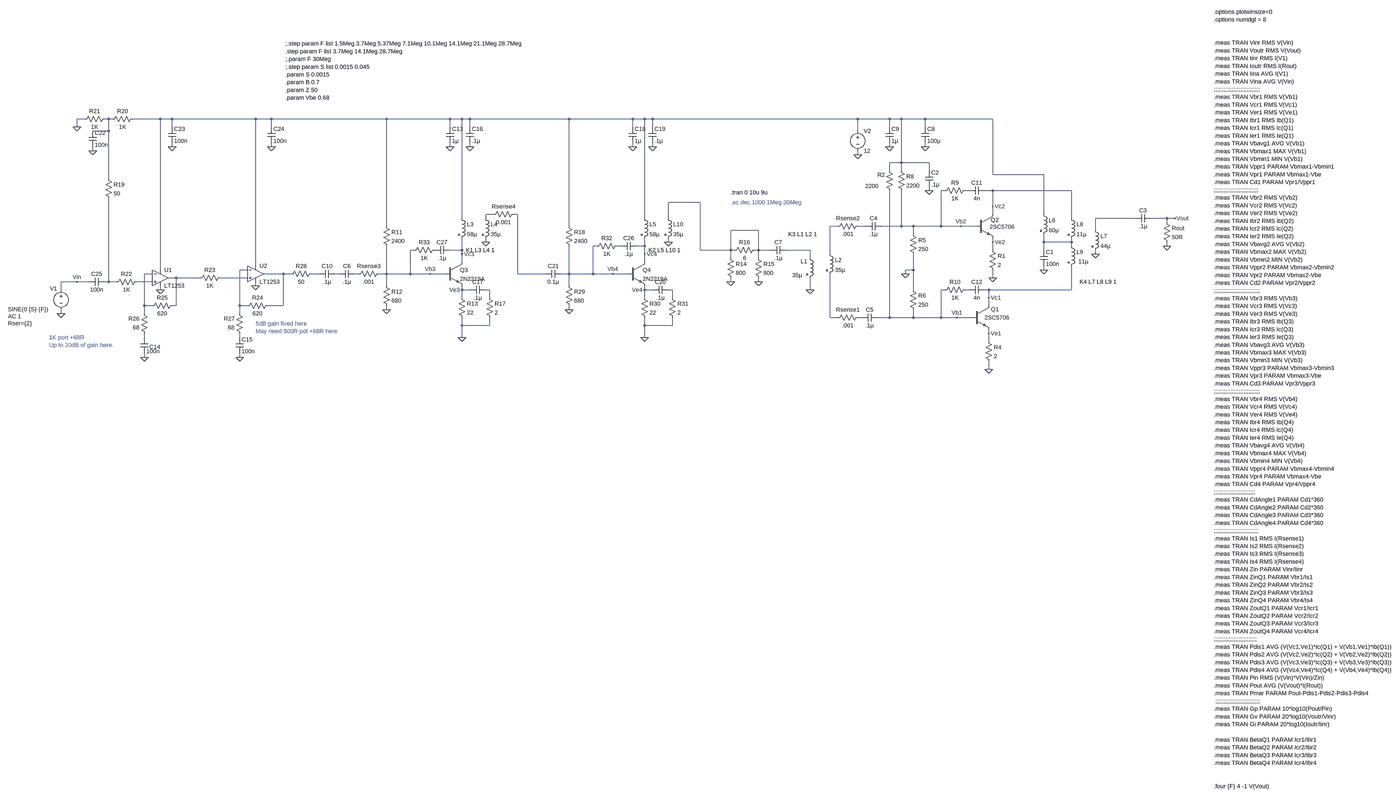
[diagram p0: schematic LT1253+2N2219+SC5706 Push-Pull.asc, whole sheet]
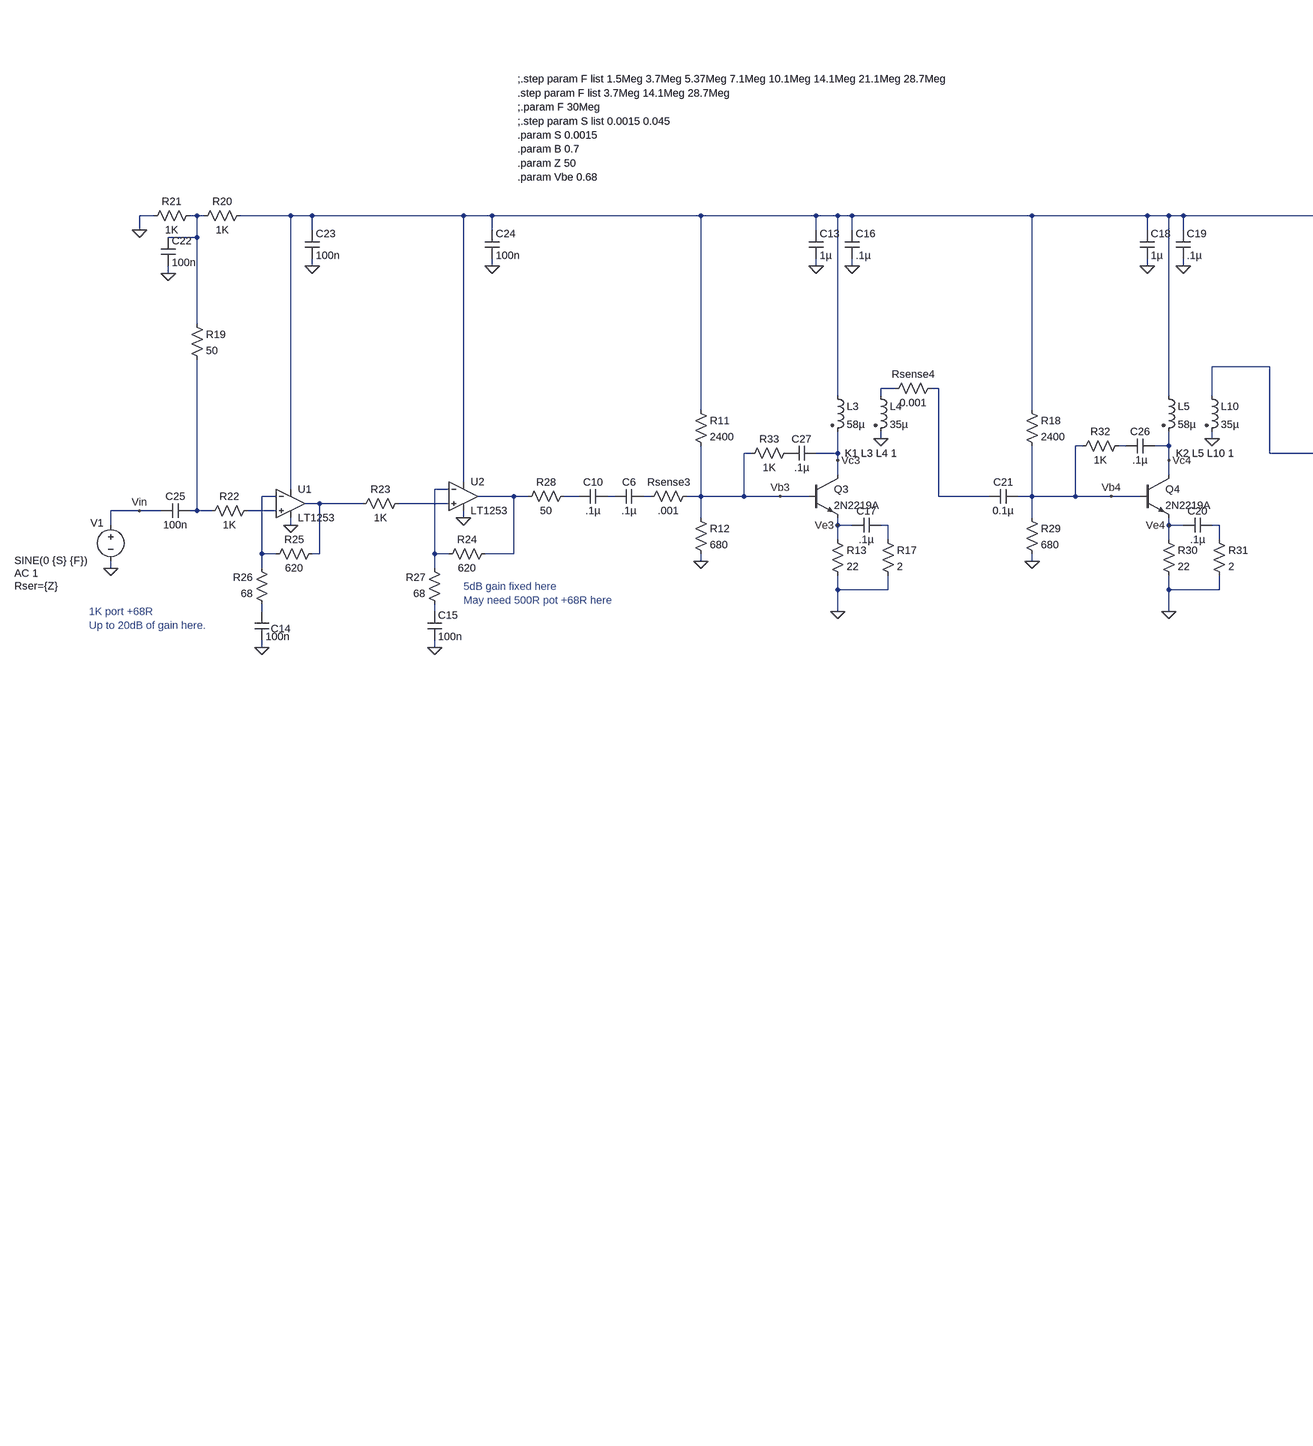
[diagram p1: schematic LT1253+2N2219+SC5706 Push-Pull.asc, part, row 1 of 1, column 1 of 2]
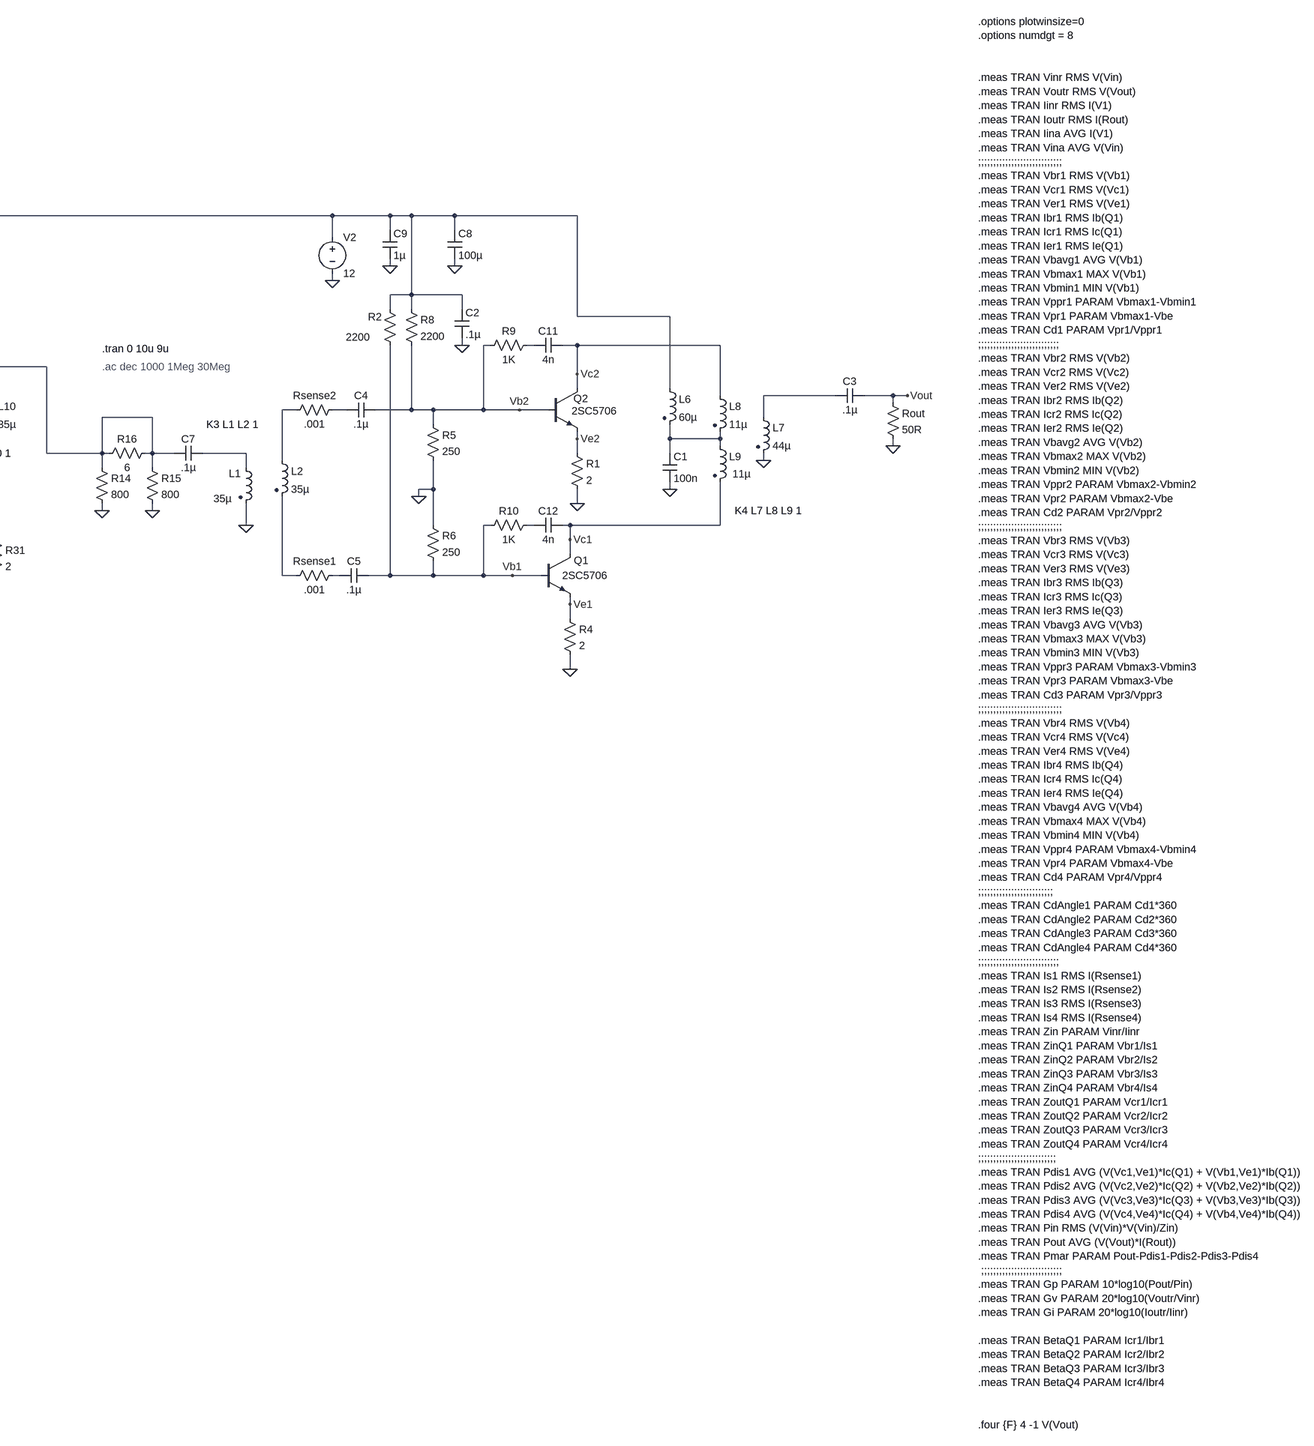
[diagram p2: schematic LT1253+2N2219+SC5706 Push-Pull.asc, part, row 1 of 1, column 2 of 2]
LT1253+2N2219+SC5706 Push-Pull.asc, the LTspice schematic file:
Version 4
SHEET 1 3748 1760
WIRE -2544 -624 -2576 -624
WIRE -2448 -624 -2464 -624
WIRE -2432 -624 -2448 -624
WIRE -2240 -624 -2352 -624
WIRE -2192 -624 -2240 -624
WIRE -1856 -624 -2192 -624
WIRE -1792 -624 -1856 -624
WIRE -1328 -624 -1792 -624
WIRE -1072 -624 -1328 -624
WIRE -1024 -624 -1072 -624
WIRE -992 -624 -1024 -624
WIRE -592 -624 -992 -624
WIRE -336 -624 -592 -624
WIRE -288 -624 -336 -624
WIRE -256 -624 -288 -624
WIRE 576 -624 -256 -624
WIRE 704 -624 576 -624
WIRE 752 -624 704 -624
WIRE 848 -624 752 -624
WIRE 1120 -624 848 -624
WIRE -2576 -592 -2576 -624
WIRE -2192 -592 -2192 -624
WIRE -1792 -592 -1792 -624
WIRE -1072 -592 -1072 -624
WIRE -992 -592 -992 -624
WIRE -336 -592 -336 -624
WIRE -256 -592 -256 -624
WIRE 704 -592 704 -624
WIRE 848 -592 848 -624
WIRE -2448 -576 -2448 -624
WIRE -2448 -576 -2512 -576
WIRE 576 -576 576 -624
WIRE -2192 -512 -2192 -528
WIRE -1792 -512 -1792 -528
WIRE -1072 -512 -1072 -528
WIRE -992 -512 -992 -528
WIRE -336 -512 -336 -528
WIRE -256 -512 -256 -528
WIRE 704 -512 704 -528
WIRE 848 -512 848 -528
WIRE -2512 -496 -2512 -512
WIRE 576 -480 576 -496
WIRE 752 -448 752 -624
WIRE 752 -448 704 -448
WIRE 864 -448 752 -448
WIRE 704 -416 704 -448
WIRE 752 -416 752 -448
WIRE 864 -416 864 -448
WIRE 1120 -400 1120 -624
WIRE 1376 -400 1120 -400
WIRE -2448 -384 -2448 -576
WIRE 864 -336 864 -352
WIRE 928 -336 912 -336
WIRE 1024 -336 1008 -336
WIRE 1120 -336 1088 -336
WIRE 1488 -336 1120 -336
WIRE -64 -288 -192 -288
WIRE 1120 -272 1120 -336
WIRE -896 -240 -928 -240
WIRE -800 -240 -816 -240
WIRE 1120 -240 1120 -272
WIRE 1376 -240 1376 -400
WIRE -1024 -224 -1024 -624
WIRE -928 -224 -928 -240
WIRE -288 -224 -288 -624
WIRE -192 -224 -192 -288
WIRE 1488 -224 1488 -336
WIRE 1744 -224 1584 -224
WIRE 1872 -224 1808 -224
WIRE 1904 -224 1872 -224
WIRE 1872 -208 1872 -224
WIRE -1328 -192 -1328 -624
WIRE -592 -192 -592 -624
WIRE 496 -192 464 -192
WIRE 608 -192 576 -192
WIRE 752 -192 752 -336
WIRE 752 -192 672 -192
WIRE 800 -192 752 -192
WIRE 912 -192 912 -336
WIRE 912 -192 800 -192
WIRE 992 -192 912 -192
WIRE 1056 -192 992 -192
WIRE 176 -176 64 -176
WIRE 1584 -176 1584 -224
WIRE 800 -160 800 -192
WIRE -928 -128 -928 -144
WIRE -192 -128 -192 -144
WIRE 1120 -128 1120 -144
WIRE 1376 -128 1376 -160
WIRE 1488 -128 1488 -144
WIRE 1488 -128 1376 -128
WIRE -480 -112 -496 -112
WIRE -384 -112 -400 -112
WIRE -288 -112 -288 -144
WIRE -288 -112 -320 -112
WIRE 1488 -112 1488 -128
WIRE 1872 -112 1872 -128
WIRE -1216 -96 -1232 -96
WIRE -1024 -96 -1024 -144
WIRE -1024 -96 -1072 -96
WIRE -64 -96 -64 -288
WIRE 64 -96 64 -176
WIRE 64 -96 -64 -96
WIRE 80 -96 64 -96
WIRE 176 -96 176 -176
WIRE 176 -96 160 -96
WIRE 224 -96 176 -96
WIRE 384 -96 288 -96
WIRE 1120 -96 1120 -128
WIRE 1376 -96 1376 -128
WIRE -1024 -80 -1024 -96
WIRE -288 -80 -288 -112
WIRE 464 -80 464 -192
WIRE 1584 -80 1584 -96
WIRE 64 -64 64 -96
WIRE 176 -64 176 -96
WIRE 384 -64 384 -96
WIRE -1024 -48 -1024 -80
WIRE -288 -48 -288 -80
WIRE -1856 -32 -1856 -624
WIRE -2240 -16 -2240 -624
WIRE -1888 -16 -1920 -16
WIRE 800 -16 800 -80
WIRE 800 -16 768 -16
WIRE 1376 -16 1376 -32
WIRE -2272 0 -2304 0
WIRE -1744 0 -1824 0
WIRE -1712 0 -1744 0
WIRE -1600 0 -1632 0
WIRE -1520 0 -1536 0
WIRE -1440 0 -1456 0
WIRE -1328 0 -1328 -112
WIRE -1328 0 -1360 0
WIRE -1232 0 -1232 -96
WIRE -1232 0 -1328 0
WIRE -1152 0 -1232 0
WIRE -1088 0 -1152 0
WIRE -800 0 -800 -240
WIRE -688 0 -800 0
WIRE -592 0 -592 -112
WIRE -592 0 -624 0
WIRE -496 0 -496 -112
WIRE -496 0 -592 0
WIRE -416 0 -496 0
WIRE -352 0 -416 0
WIRE 768 0 768 -16
WIRE -2176 16 -2208 16
WIRE -2080 16 -2176 16
WIRE -1888 16 -2000 16
WIRE 1120 16 1120 -16
WIRE -2576 32 -2640 32
WIRE -2528 32 -2576 32
WIRE -2448 32 -2448 -304
WIRE -2448 32 -2464 32
WIRE -2416 32 -2448 32
WIRE -2272 32 -2336 32
WIRE 64 32 64 16
WIRE 176 32 176 16
WIRE -1856 48 -1856 32
WIRE -1328 48 -1328 0
WIRE -592 48 -592 0
WIRE -2640 64 -2640 32
WIRE -2240 64 -2240 48
WIRE -1024 64 -1024 48
WIRE -992 64 -1024 64
WIRE -912 64 -928 64
WIRE -288 64 -288 48
WIRE -256 64 -288 64
WIRE -176 64 -192 64
WIRE 384 64 384 16
WIRE 800 64 800 -16
WIRE 928 64 912 64
WIRE 1024 64 1008 64
WIRE 1104 64 1088 64
WIRE 1488 64 1488 -32
WIRE 1488 64 1104 64
WIRE -1024 96 -1024 64
WIRE -912 96 -912 64
WIRE -288 96 -288 64
WIRE -176 96 -176 64
WIRE 1104 96 1104 64
WIRE -2304 128 -2304 0
WIRE -2272 128 -2304 128
WIRE -2176 128 -2176 16
WIRE -2176 128 -2192 128
WIRE -1920 128 -1920 -16
WIRE -1888 128 -1920 128
WIRE -1744 128 -1744 0
WIRE -1744 128 -1808 128
WIRE 1104 128 1104 96
WIRE -1328 144 -1328 128
WIRE -592 144 -592 128
WIRE -2640 160 -2640 144
WIRE -2304 160 -2304 128
WIRE -1920 160 -1920 128
WIRE 464 176 464 0
WIRE 496 176 464 176
WIRE 592 176 576 176
WIRE 704 176 704 -336
WIRE 704 176 656 176
WIRE 800 176 800 144
WIRE 800 176 704 176
WIRE 912 176 912 64
WIRE 912 176 800 176
WIRE 976 176 912 176
WIRE 1040 176 976 176
WIRE -1024 208 -1024 176
WIRE -912 208 -912 176
WIRE -912 208 -1024 208
WIRE -288 208 -288 176
WIRE -176 208 -176 176
WIRE -176 208 -288 208
WIRE 1104 240 1104 224
WIRE -2304 256 -2304 240
WIRE -1920 256 -1920 240
WIRE -1024 256 -1024 208
WIRE -288 256 -288 208
WIRE 1104 272 1104 240
WIRE -2304 336 -2304 320
WIRE -1920 336 -1920 320
WIRE 1104 384 1104 352
FLAG 576 -480 0
FLAG -2640 160 0
FLAG 1104 384 0
FLAG 1904 -224 Vout
FLAG 1872 -112 0
FLAG 976 176 Vb1
FLAG 1104 240 Ve1
FLAG -2576 32 Vin
FLAG 1104 96 Vc1
FLAG 1120 16 0
FLAG 992 -192 Vb2
FLAG 1120 -128 Ve2
FLAG 1120 -272 Vc2
FLAG 384 64 0
FLAG 768 0 0
FLAG 1376 -16 0
FLAG 864 -336 0
FLAG 704 -512 0
FLAG 1584 -80 0
FLAG 848 -512 0
FLAG 64 32 0
FLAG 176 32 0
FLAG -2192 -512 0
FLAG -2512 -496 0
FLAG -2240 64 0
FLAG -1856 48 0
FLAG -1920 336 0
FLAG -1792 -512 0
FLAG -2576 -592 0
FLAG -2304 336 0
FLAG -1328 144 0
FLAG -1024 256 0
FLAG -1072 -512 0
FLAG -992 -512 0
FLAG -1152 0 Vb3
FLAG -1024 64 Ve3
FLAG -1024 -80 Vc3
FLAG -928 -128 0
FLAG -592 144 0
FLAG -288 256 0
FLAG -336 -512 0
FLAG -256 -512 0
FLAG -416 0 Vb4
FLAG -288 64 Ve4
FLAG -288 -80 Vc4
FLAG -192 -128 0
SYMBOL npn 1040 128 R0
WINDOW 0 73 15 Left 2
WINDOW 3 47 48 Left 2
SYMATTR InstName Q1
SYMATTR Value 2SC5706
SYMBOL voltage -2640 48 R0
WINDOW 0 -45 11 Left 2
WINDOW 3 -214 95 Left 2
WINDOW 123 -214 123 Left 2
WINDOW 39 -214 151 Left 2
SYMATTR InstName V1
SYMATTR Value SINE(0 {S} {F})
SYMATTR Value2 AC 1
SYMATTR SpiceLine Rser={Z}
SYMBOL voltage 576 -592 R0
WINDOW 123 0 0 Left 0
WINDOW 39 0 0 Left 0
SYMATTR InstName V2
SYMATTR Value 12
SYMBOL res 1088 256 R0
SYMATTR InstName R4
SYMATTR Value 2
SYMBOL cap 1808 -240 R90
WINDOW 0 0 32 VBottom 2
WINDOW 3 32 32 VTop 2
SYMATTR InstName C3
SYMATTR Value .1µ
SYMBOL res 1856 -224 R0
SYMATTR InstName Rout
SYMATTR Value 50R
SYMBOL cap 288 -112 R90
WINDOW 0 0 32 VBottom 2
WINDOW 3 32 32 VTop 2
SYMATTR InstName C7
SYMATTR Value .1µ
SYMBOL npn 1056 -240 R0
WINDOW 0 56 23 Left 2
WINDOW 3 52 50 Left 2
SYMATTR InstName Q2
SYMATTR Value 2SC5706
SYMBOL res 1104 -112 R0
SYMATTR InstName R1
SYMATTR Value 2
SYMBOL ind2 368 -80 R0
WINDOW 0 -22 29 Left 2
WINDOW 3 -56 85 Left 2
SYMATTR InstName L1
SYMATTR Value 35µ
SYMATTR Type ind
SYMBOL ind2 448 -96 R0
SYMATTR InstName L2
SYMATTR Value 35µ
SYMATTR Type ind
SYMBOL res 736 -432 R0
SYMATTR InstName R8
SYMATTR Value 2200
SYMBOL res 784 -176 R0
SYMATTR InstName R5
SYMATTR Value 250
SYMBOL res 784 48 R0
SYMATTR InstName R6
SYMATTR Value 250
SYMBOL ind2 1472 -240 R0
SYMATTR InstName L8
SYMATTR Value 11µ
SYMATTR Type ind
SYMBOL ind2 1472 -128 R0
WINDOW 3 43 78 Left 2
SYMATTR Value 11µ
SYMATTR InstName L9
SYMATTR Type ind
SYMBOL ind2 1568 -192 R0
SYMATTR InstName L7
SYMATTR Value 44µ
SYMATTR Type ind
SYMBOL ind2 1360 -256 R0
SYMATTR InstName L6
SYMATTR Value 60µ
SYMATTR Type ind
SYMBOL cap 1360 -96 R0
SYMATTR InstName C1
SYMATTR Value 100n
SYMBOL cap 848 -416 R0
SYMATTR InstName C2
SYMATTR Value .1µ
SYMBOL cap 688 -592 R0
SYMATTR InstName C9
SYMATTR Value 1µ
SYMBOL res 688 -432 R0
WINDOW 0 -33 33 Left 2
WINDOW 3 -82 78 Left 2
SYMATTR InstName R2
SYMATTR Value 2200
SYMBOL cap 832 -592 R0
SYMATTR InstName C8
SYMATTR Value 100µ
SYMBOL res 592 -208 R90
WINDOW 0 0 56 VBottom 2
WINDOW 3 32 56 VTop 2
SYMATTR InstName Rsense2
SYMATTR Value .001
SYMBOL res 592 160 R90
WINDOW 0 0 56 VBottom 2
WINDOW 3 32 56 VTop 2
SYMATTR InstName Rsense1
SYMATTR Value .001
SYMBOL cap 672 -208 R90
WINDOW 0 0 32 VBottom 2
WINDOW 3 32 32 VTop 2
SYMATTR InstName C4
SYMATTR Value .1µ
SYMBOL cap 656 160 R90
WINDOW 0 0 32 VBottom 2
WINDOW 3 32 32 VTop 2
SYMATTR InstName C5
SYMATTR Value .1µ
SYMBOL cap 1088 -352 R90
WINDOW 0 0 32 VBottom 2
WINDOW 3 32 32 VTop 2
SYMATTR InstName C11
SYMATTR Value 4n
SYMBOL res 1024 -352 R90
WINDOW 0 0 56 VBottom 2
WINDOW 3 32 56 VTop 2
SYMATTR InstName R9
SYMATTR Value 1K
SYMBOL cap 1088 48 R90
WINDOW 0 0 32 VBottom 2
WINDOW 3 32 32 VTop 2
SYMATTR InstName C12
SYMATTR Value 4n
SYMBOL res 1024 48 R90
WINDOW 0 0 56 VBottom 2
WINDOW 3 32 56 VTop 2
SYMATTR InstName R10
SYMATTR Value 1K
SYMBOL res 48 -80 R0
SYMATTR InstName R14
SYMATTR Value 800
SYMBOL res 160 -80 R0
SYMATTR InstName R15
SYMATTR Value 800
SYMBOL res 176 -112 R90
WINDOW 0 0 56 VBottom 2
WINDOW 3 32 56 VTop 2
SYMATTR InstName R16
SYMATTR Value 6
SYMBOL Opamps\\LT1253 -2240 -48 R0
SYMATTR InstName U1
SYMBOL Opamps\\LT1253 -1856 -64 R0
SYMATTR InstName U2
SYMBOL res -2464 -400 R0
SYMATTR InstName R19
SYMATTR Value 50
SYMBOL res -2336 -640 R90
WINDOW 0 0 56 VBottom 2
WINDOW 3 32 56 VTop 2
SYMATTR InstName R20
SYMATTR Value 1K
SYMBOL res -2448 -640 R90
WINDOW 0 0 56 VBottom 2
WINDOW 3 32 56 VTop 2
SYMATTR InstName R21
SYMATTR Value 1K
SYMBOL res -2320 16 R90
WINDOW 0 0 56 VBottom 2
WINDOW 3 32 56 VTop 2
SYMATTR InstName R22
SYMATTR Value 1K
SYMBOL res -1984 0 R90
WINDOW 0 0 56 VBottom 2
WINDOW 3 32 56 VTop 2
SYMATTR InstName R23
SYMATTR Value 1K
SYMBOL res -1792 112 R90
WINDOW 0 0 56 VBottom 2
WINDOW 3 32 56 VTop 2
SYMATTR InstName R24
SYMATTR Value 620
SYMBOL res -2176 112 R90
WINDOW 0 0 56 VBottom 2
WINDOW 3 32 56 VTop 2
SYMATTR InstName R25
SYMATTR Value 620
SYMBOL res -2288 256 R180
WINDOW 0 36 76 Left 2
WINDOW 3 36 40 Left 2
SYMATTR InstName R26
SYMATTR Value 68
SYMBOL res -1904 256 R180
WINDOW 0 36 76 Left 2
WINDOW 3 36 40 Left 2
SYMATTR InstName R27
SYMATTR Value 68
SYMBOL cap -2320 256 R0
WINDOW 0 36 38 Left 2
SYMATTR InstName C14
SYMATTR Value 100n
SYMBOL cap -1936 256 R0
SYMATTR InstName C15
SYMATTR Value 100n
SYMBOL cap -2528 -576 R0
SYMATTR InstName C22
SYMATTR Value 100n
SYMBOL cap -2208 -592 R0
SYMATTR InstName C23
SYMATTR Value 100n
SYMBOL cap -1808 -592 R0
SYMATTR InstName C24
SYMATTR Value 100n
SYMBOL cap -2464 16 R90
WINDOW 0 0 32 VBottom 2
WINDOW 3 32 32 VTop 2
SYMATTR InstName C25
SYMATTR Value 100n
SYMBOL res -1616 -16 R90
WINDOW 0 0 56 VBottom 2
WINDOW 3 32 56 VTop 2
SYMATTR InstName R28
SYMATTR Value 50
SYMBOL res -1344 -16 R90
WINDOW 0 0 56 VBottom 2
WINDOW 3 32 56 VTop 2
SYMATTR InstName Rsense3
SYMATTR Value .001
SYMBOL res -1344 -208 R0
SYMATTR InstName R11
SYMATTR Value 2400
SYMBOL res -1344 32 R0
SYMATTR InstName R12
SYMATTR Value 680
SYMBOL res -1040 80 R0
SYMATTR InstName R13
SYMATTR Value 22
SYMBOL ind2 -1040 -240 R0
SYMATTR InstName L3
SYMATTR Value 58µ
SYMATTR Type ind
SYMBOL cap -1088 -592 R0
SYMATTR InstName C13
SYMATTR Value 1µ
SYMBOL cap -1008 -592 R0
SYMATTR InstName C16
SYMATTR Value .1µ
SYMBOL cap -928 48 R90
WINDOW 0 0 32 VBottom 2
WINDOW 3 32 32 VTop 2
SYMATTR InstName C17
SYMATTR Value .1µ
SYMBOL ind2 -944 -240 R0
SYMATTR InstName L4
SYMATTR Value 35µ
SYMATTR Type ind
SYMBOL npn -1088 -48 R0
SYMATTR InstName Q3
SYMATTR Value 2N2219A
SYMBOL res -928 80 R0
SYMATTR InstName R17
SYMATTR Value 2
SYMBOL res -608 -208 R0
SYMATTR InstName R18
SYMATTR Value 2400
SYMBOL res -608 32 R0
SYMATTR InstName R29
SYMATTR Value 680
SYMBOL res -304 80 R0
SYMATTR InstName R30
SYMATTR Value 22
SYMBOL ind2 -304 -240 R0
SYMATTR InstName L5
SYMATTR Value 58µ
SYMATTR Type ind
SYMBOL cap -352 -592 R0
SYMATTR InstName C18
SYMATTR Value 1µ
SYMBOL cap -272 -592 R0
SYMATTR InstName C19
SYMATTR Value .1µ
SYMBOL cap -192 48 R90
WINDOW 0 0 32 VBottom 2
WINDOW 3 32 32 VTop 2
SYMATTR InstName C20
SYMATTR Value .1µ
SYMBOL ind2 -208 -240 R0
SYMATTR InstName L10
SYMATTR Value 35µ
SYMATTR Type ind
SYMBOL npn -352 -48 R0
SYMATTR InstName Q4
SYMATTR Value 2N2219A
SYMBOL res -192 80 R0
SYMATTR InstName R31
SYMATTR Value 2
SYMBOL cap -624 -16 R90
WINDOW 0 0 32 VBottom 2
WINDOW 3 32 32 VTop 2
SYMATTR InstName C21
SYMATTR Value 0.1µ
SYMBOL res -800 -256 R90
WINDOW 0 0 56 VBottom 2
WINDOW 3 32 56 VTop 2
SYMATTR InstName Rsense4
SYMATTR Value 0.001
SYMBOL cap -320 -128 R90
WINDOW 0 0 32 VBottom 2
WINDOW 3 32 32 VTop 2
SYMATTR InstName C26
SYMATTR Value .1µ
SYMBOL res -384 -128 R90
WINDOW 0 0 56 VBottom 2
WINDOW 3 32 56 VTop 2
SYMATTR InstName R32
SYMATTR Value 1K
SYMBOL cap -1072 -112 R90
WINDOW 0 0 32 VBottom 2
WINDOW 3 32 32 VTop 2
SYMATTR InstName C27
SYMATTR Value .1µ
SYMBOL res -1120 -112 R90
WINDOW 0 0 56 VBottom 2
WINDOW 3 32 56 VTop 2
SYMATTR InstName R33
SYMATTR Value 1K
SYMBOL cap -1456 -16 R90
WINDOW 0 0 32 VBottom 2
WINDOW 3 32 32 VTop 2
SYMATTR InstName C6
SYMATTR Value .1µ
SYMBOL cap -1536 -16 R90
WINDOW 0 0 32 VBottom 2
WINDOW 3 32 32 VTop 2
SYMATTR InstName C10
SYMATTR Value .1µ
TEXT 64 -328 Left 2 !.tran 0 10u 9u
TEXT 2248 -1056 Left 2 !.options plotwinsize=0\n.options numdgt = 8\n \n \n.meas TRAN Vinr RMS V(Vin)\n.meas TRAN Voutr RMS V(Vout)\n.meas TRAN Iinr RMS I(V1)\n.meas TRAN Ioutr RMS I(Rout)\n.meas TRAN Iina AVG I(V1)\n.meas TRAN Vina AVG V(Vin)\n;;;;;;;;;;;;;;;;;;;;;;;;;;;;\n.meas TRAN Vbr1 RMS V(Vb1)\n.meas TRAN Vcr1 RMS V(Vc1)\n.meas TRAN Ver1 RMS V(Ve1)\n.meas TRAN Ibr1 RMS Ib(Q1)\n.meas TRAN Icr1 RMS Ic(Q1)\n.meas TRAN Ier1 RMS Ie(Q1)\n.meas TRAN Vbavg1 AVG V(Vb1)\n.meas TRAN Vbmax1 MAX V(Vb1)\n.meas TRAN Vbmin1 MIN V(Vb1)\n.meas TRAN Vppr1 PARAM Vbmax1-Vbmin1\n.meas TRAN Vpr1 PARAM Vbmax1-Vbe\n.meas TRAN Cd1 PARAM Vpr1/Vppr1\n;;;;;;;;;;;;;;;;;;;;;;;;;;;\n.meas TRAN Vbr2 RMS V(Vb2)\n.meas TRAN Vcr2 RMS V(Vc2)\n.meas TRAN Ver2 RMS V(Ve2)\n.meas TRAN Ibr2 RMS Ib(Q2)\n.meas TRAN Icr2 RMS Ic(Q2)\n.meas TRAN Ier2 RMS Ie(Q2)\n.meas TRAN Vbavg2 AVG V(Vb2)\n.meas TRAN Vbmax2 MAX V(Vb2)\n.meas TRAN Vbmin2 MIN V(Vb2)\n.meas TRAN Vppr2 PARAM Vbmax2-Vbmin2\n.meas TRAN Vpr2 PARAM Vbmax2-Vbe\n.meas TRAN Cd2 PARAM Vpr2/Vppr2\n;;;;;;;;;;;;;;;;;;;;;;;;;;;;\n.meas TRAN Vbr3 RMS V(Vb3)\n.meas TRAN Vcr3 RMS V(Vc3)\n.meas TRAN Ver3 RMS V(Ve3)\n.meas TRAN Ibr3 RMS Ib(Q3)\n.meas TRAN Icr3 RMS Ic(Q3)\n.meas TRAN Ier3 RMS Ie(Q3)\n.meas TRAN Vbavg3 AVG V(Vb3)\n.meas TRAN Vbmax3 MAX V(Vb3)\n.meas TRAN Vbmin3 MIN V(Vb3)\n.meas TRAN Vppr3 PARAM Vbmax3-Vbmin3\n.meas TRAN Vpr3 PARAM Vbmax3-Vbe\n.meas TRAN Cd3 PARAM Vpr3/Vppr3\n;;;;;;;;;;;;;;;;;;;;;;;;;;;;\n.meas TRAN Vbr4 RMS V(Vb4)\n.meas TRAN Vcr4 RMS V(Vc4)\n.meas TRAN Ver4 RMS V(Ve4)\n.meas TRAN Ibr4 RMS Ib(Q4)\n.meas TRAN Icr4 RMS Ic(Q4)\n.meas TRAN Ier4 RMS Ie(Q4)\n.meas TRAN Vbavg4 AVG V(Vb4)\n.meas TRAN Vbmax4 MAX V(Vb4)\n.meas TRAN Vbmin4 MIN V(Vb4)\n.meas TRAN Vppr4 PARAM Vbmax4-Vbmin4\n.meas TRAN Vpr4 PARAM Vbmax4-Vbe\n.meas TRAN Cd4 PARAM Vpr4/Vppr4\n;;;;;;;;;;;;;;;;;;;;;;;;;\n.meas TRAN CdAngle1 PARAM Cd1*360\n.meas TRAN CdAngle2 PARAM Cd2*360\n.meas TRAN CdAngle3 PARAM Cd3*360\n.meas TRAN CdAngle4 PARAM Cd4*360\n;;;;;;;;;;;;;;;;;;;;;;;;;;;\n.meas TRAN Is1 RMS I(Rsense1)\n.meas TRAN Is2 RMS I(Rsense2)\n.meas TRAN Is3 RMS I(Rsense3)\n.meas TRAN Is4 RMS I(Rsense4)\n.meas TRAN Zin PARAM Vinr/Iinr\n.meas TRAN ZinQ1 PARAM Vbr1/Is1\n.meas TRAN ZinQ2 PARAM Vbr2/Is2 \n.meas TRAN ZinQ3 PARAM Vbr3/Is3 \n.meas TRAN ZinQ4 PARAM Vbr4/Is4 \n.meas TRAN ZoutQ1 PARAM Vcr1/Icr1\n.meas TRAN ZoutQ2 PARAM Vcr2/Icr2\n.meas TRAN ZoutQ3 PARAM Vcr3/Icr3\n.meas TRAN ZoutQ4 PARAM Vcr4/Icr4\n;;;;;;;;;;;;;;;;;;;;;;;;;;\n.meas TRAN Pdis1 AVG (V(Vc1,Ve1)*Ic(Q1) + V(Vb1,Ve1)*Ib(Q1))\n.meas TRAN Pdis2 AVG (V(Vc2,Ve2)*Ic(Q2) + V(Vb2,Ve2)*Ib(Q2))\n.meas TRAN Pdis3 AVG (V(Vc3,Ve3)*Ic(Q3) + V(Vb3,Ve3)*Ib(Q3))\n.meas TRAN Pdis4 AVG (V(Vc4,Ve4)*Ic(Q4) + V(Vb4,Ve4)*Ib(Q4))\n.meas TRAN Pin RMS (V(Vin)*V(Vin)/Zin)\n.meas TRAN Pout AVG (V(Vout)*I(Rout))\n.meas TRAN Pmar PARAM Pout-Pdis1-Pdis2-Pdis3-Pdis4\n ;;;;;;;;;;;;;;;;;;;;;;;;;;;\n.meas TRAN Gp PARAM 10*log10(Pout/Pin)\n.meas TRAN Gv PARAM 20*log10(Voutr/Vinr)\n.meas TRAN Gi PARAM 20*log10(Ioutr/Iinr)\n \n.meas TRAN BetaQ1 PARAM Icr1/Ibr1\n.meas TRAN BetaQ2 PARAM Icr2/Ibr2\n.meas TRAN BetaQ3 PARAM Icr3/Ibr3\n.meas TRAN BetaQ4 PARAM Icr4/Ibr4\n \n \n.four {F} 4 -1 V(Vout)
TEXT -1736 -928 Left 2 !;.step param F list 1.5Meg 3.7Meg 5.37Meg 7.1Meg 10.1Meg 14.1Meg 21.1Meg 28.7Meg\n.step param F list 3.7Meg 14.1Meg 28.7Meg\n;.param F 30Meg\n;.step param S list 0.0015 0.045\n.param S 0.0015\n.param B 0.7\n.param Z 50\n.param Vbe 0.68
TEXT 64 -288 Left 2 ;.ac dec 1000 1Meg 30Meg
TEXT 1520 32 Left 2 !K4 L7 L8 L9 1
TEXT 296 -160 Left 2 !K3 L1 L2 1
TEXT -1856 200 Left 2 ;5dB gain fixed here\nMay need 500R pot +68R here
TEXT -2688 256 Left 2 ;1K port +68R  \nUp to 20dB of gain here.
TEXT -1008 -96 Left 2 !K1 L3 L4 1
TEXT -272 -96 Left 2 !K2 L5 L10 1

The netlist it stands for:
* LT1253+2N2219+SC5706 Push-Pull.asc
Q1 Vc1 Vb1 Ve1 0 2SC5706
V1 Vin 0 SINE(0 {S} {F}) AC 1 Rser={Z}
V2 N002 0 12
R4 Ve1 0 2
C3 Vout N007 .1µ
Rout Vout 0 50R
C7 N012 N004 .1µ
Q2 Vc2 Vb2 Ve2 0 2SC5706
R1 Ve2 0 2
L1 N012 0 35µ
L2 N008 N026 35µ
R8 N002 Vb2 2200
R5 Vb2 0 250
R6 0 Vb1 250
L8 Vc2 N010 11µ
L9 N010 Vc1 11µ
L7 N007 0 44µ
L6 N002 N010 60µ
C1 N010 0 100n
C2 N002 0 .1µ
C9 N002 0 1µ
R2 N002 Vb1 2200
C8 N002 0 100µ
Rsense2 N009 N008 .001
Rsense1 N027 N026 .001
C4 Vb2 N009 .1µ
C5 Vb1 N027 .1µ
C11 Vc2 N003 4n
R9 N003 Vb2 1K
C12 Vc1 N025 4n
R10 N025 Vb1 1K
R14 N004 0 800
R15 N004 0 800
R16 N004 N004 6
XU1 N022 N014 N002 0 N019 LT1253  ; pins In+ In- V+ V- OUT
XU2 N020 N013 N002 0 N015 LT1253  ; pins In+ In- V+ V- OUT
R19 N001 N021 50
R20 N002 N001 1K
R21 N001 0 1K
R22 N022 N021 1K
R23 N020 N019 1K
R24 N015 N013 620
R25 N019 N014 620
R26 N028 N014 68
R27 N029 N013 68
C14 N028 0 100n
C15 N029 0 100n
C22 N001 0 100n
C23 N002 0 100n
C24 N002 0 100n
C25 N021 Vin 100n
R28 N016 N015 50
Rsense3 Vb3 N018 .001
R11 N002 Vb3 2400
R12 Vb3 0 680
R13 Ve3 0 22
L3 N002 Vc3 58µ
C13 N002 0 1µ
C16 N002 0 .1µ
C17 N023 Ve3 .1µ
L4 N005 0 35µ
Q3 Vc3 Vb3 Ve3 0 2N2219A
R17 N023 0 2
R18 N002 Vb4 2400
R29 Vb4 0 680
R30 Ve4 0 22
L5 N002 Vc4 58µ
C18 N002 0 1µ
C19 N002 0 .1µ
C20 N024 Ve4 .1µ
L10 N004 0 35µ
Q4 Vc4 Vb4 Ve4 0 2N2219A
R31 N024 0 2
C21 Vb4 N006 0.1µ
Rsense4 N006 N005 0.001
C26 Vc4 N011 .1µ
R32 N011 Vb4 1K
C27 Vc3 P001 .1µ
R33 P001 Vb3 1K
C6 N018 N017 .1µ
C10 N017 N016 .1µ
.model NPN NPN
.model PNP PNP
.lib standard.bjt
.tran 0 10u 9u
.options plotwinsize=0
.options numdgt = 8
.meas TRAN Vinr RMS V(Vin)
.meas TRAN Voutr RMS V(Vout)
.meas TRAN Iinr RMS I(V1)
.meas TRAN Ioutr RMS I(Rout)
.meas TRAN Iina AVG I(V1)
.meas TRAN Vina AVG V(Vin)
;;;;;;;;;;;;;;;;;;;;;;;;;;;;
.meas TRAN Vbr1 RMS V(Vb1)
.meas TRAN Vcr1 RMS V(Vc1)
.meas TRAN Ver1 RMS V(Ve1)
.meas TRAN Ibr1 RMS Ib(Q1)
.meas TRAN Icr1 RMS Ic(Q1)
.meas TRAN Ier1 RMS Ie(Q1)
.meas TRAN Vbavg1 AVG V(Vb1)
.meas TRAN Vbmax1 MAX V(Vb1)
.meas TRAN Vbmin1 MIN V(Vb1)
.meas TRAN Vppr1 PARAM Vbmax1-Vbmin1
.meas TRAN Vpr1 PARAM Vbmax1-Vbe
.meas TRAN Cd1 PARAM Vpr1/Vppr1
;;;;;;;;;;;;;;;;;;;;;;;;;;;
.meas TRAN Vbr2 RMS V(Vb2)
.meas TRAN Vcr2 RMS V(Vc2)
.meas TRAN Ver2 RMS V(Ve2)
.meas TRAN Ibr2 RMS Ib(Q2)
.meas TRAN Icr2 RMS Ic(Q2)
.meas TRAN Ier2 RMS Ie(Q2)
.meas TRAN Vbavg2 AVG V(Vb2)
.meas TRAN Vbmax2 MAX V(Vb2)
.meas TRAN Vbmin2 MIN V(Vb2)
.meas TRAN Vppr2 PARAM Vbmax2-Vbmin2
.meas TRAN Vpr2 PARAM Vbmax2-Vbe
.meas TRAN Cd2 PARAM Vpr2/Vppr2
;;;;;;;;;;;;;;;;;;;;;;;;;;;;
.meas TRAN Vbr3 RMS V(Vb3)
.meas TRAN Vcr3 RMS V(Vc3)
.meas TRAN Ver3 RMS V(Ve3)
.meas TRAN Ibr3 RMS Ib(Q3)
.meas TRAN Icr3 RMS Ic(Q3)
.meas TRAN Ier3 RMS Ie(Q3)
.meas TRAN Vbavg3 AVG V(Vb3)
.meas TRAN Vbmax3 MAX V(Vb3)
.meas TRAN Vbmin3 MIN V(Vb3)
.meas TRAN Vppr3 PARAM Vbmax3-Vbmin3
.meas TRAN Vpr3 PARAM Vbmax3-Vbe
.meas TRAN Cd3 PARAM Vpr3/Vppr3
;;;;;;;;;;;;;;;;;;;;;;;;;;;;
.meas TRAN Vbr4 RMS V(Vb4)
.meas TRAN Vcr4 RMS V(Vc4)
.meas TRAN Ver4 RMS V(Ve4)
.meas TRAN Ibr4 RMS Ib(Q4)
.meas TRAN Icr4 RMS Ic(Q4)
.meas TRAN Ier4 RMS Ie(Q4)
.meas TRAN Vbavg4 AVG V(Vb4)
.meas TRAN Vbmax4 MAX V(Vb4)
.meas TRAN Vbmin4 MIN V(Vb4)
.meas TRAN Vppr4 PARAM Vbmax4-Vbmin4
.meas TRAN Vpr4 PARAM Vbmax4-Vbe
.meas TRAN Cd4 PARAM Vpr4/Vppr4
;;;;;;;;;;;;;;;;;;;;;;;;;
.meas TRAN CdAngle1 PARAM Cd1*360
.meas TRAN CdAngle2 PARAM Cd2*360
.meas TRAN CdAngle3 PARAM Cd3*360
.meas TRAN CdAngle4 PARAM Cd4*360
;;;;;;;;;;;;;;;;;;;;;;;;;;;
.meas TRAN Is1 RMS I(Rsense1)
.meas TRAN Is2 RMS I(Rsense2)
.meas TRAN Is3 RMS I(Rsense3)
.meas TRAN Is4 RMS I(Rsense4)
.meas TRAN Zin PARAM Vinr/Iinr
.meas TRAN ZinQ1 PARAM Vbr1/Is1
.meas TRAN ZinQ2 PARAM Vbr2/Is2
.meas TRAN ZinQ3 PARAM Vbr3/Is3
.meas TRAN ZinQ4 PARAM Vbr4/Is4
.meas TRAN ZoutQ1 PARAM Vcr1/Icr1
.meas TRAN ZoutQ2 PARAM Vcr2/Icr2
.meas TRAN ZoutQ3 PARAM Vcr3/Icr3
.meas TRAN ZoutQ4 PARAM Vcr4/Icr4
;;;;;;;;;;;;;;;;;;;;;;;;;;
.meas TRAN Pdis1 AVG (V(Vc1,Ve1)*Ic(Q1) + V(Vb1,Ve1)*Ib(Q1))
.meas TRAN Pdis2 AVG (V(Vc2,Ve2)*Ic(Q2) + V(Vb2,Ve2)*Ib(Q2))
.meas TRAN Pdis3 AVG (V(Vc3,Ve3)*Ic(Q3) + V(Vb3,Ve3)*Ib(Q3))
.meas TRAN Pdis4 AVG (V(Vc4,Ve4)*Ic(Q4) + V(Vb4,Ve4)*Ib(Q4))
.meas TRAN Pin RMS (V(Vin)*V(Vin)/Zin)
.meas TRAN Pout AVG (V(Vout)*I(Rout))
.meas TRAN Pmar PARAM Pout-Pdis1-Pdis2-Pdis3-Pdis4
 ;;;;;;;;;;;;;;;;;;;;;;;;;;;
.meas TRAN Gp PARAM 10*log10(Pout/Pin)
.meas TRAN Gv PARAM 20*log10(Voutr/Vinr)
.meas TRAN Gi PARAM 20*log10(Ioutr/Iinr)
.meas TRAN BetaQ1 PARAM Icr1/Ibr1
.meas TRAN BetaQ2 PARAM Icr2/Ibr2
.meas TRAN BetaQ3 PARAM Icr3/Ibr3
.meas TRAN BetaQ4 PARAM Icr4/Ibr4
.four {F} 4 -1 V(Vout)
;.step param F list 1.5Meg 3.7Meg 5.37Meg 7.1Meg 10.1Meg 14.1Meg 21.1Meg 28.7Meg
.step param F list 3.7Meg 14.1Meg 28.7Meg
;.param F 30Meg
;.step param S list 0.0015 0.045
.param S 0.0015
.param B 0.7
.param Z 50
.param Vbe 0.68
* .ac dec 1000 1Meg 30Meg
K4 L7 L8 L9 1
K3 L1 L2 1
* 5dB gain fixed here
* May need 500R pot +68R here
* 1K port +68R
* Up to 20dB of gain here.
K1 L3 L4 1
K2 L5 L10 1
.backanno
.end